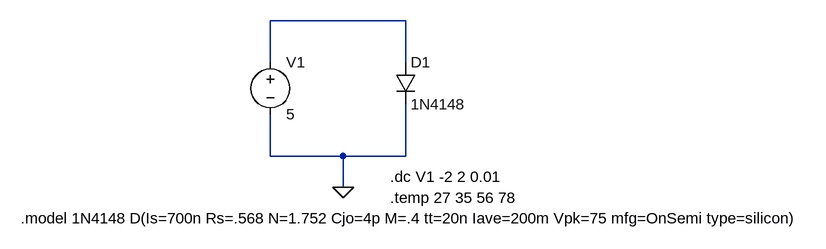
[diagram p0: schematic 1_a_Diodo_Analisis_temp_diferentes.asc]
1_a_Diodo_Analisis_temp_diferentes.asc, the LTspice schematic file:
Version 4
SHEET 1 880 680
WIRE 112 48 -96 48
WIRE -96 112 -96 48
WIRE 112 112 112 48
WIRE -96 256 -96 192
WIRE 16 256 -96 256
WIRE 112 256 112 176
WIRE 112 256 16 256
WIRE 16 304 16 256
FLAG 16 304 0
SYMBOL diode 96 112 R0
SYMATTR InstName D1
SYMATTR Value 1N4148
SYMBOL voltage -96 96 R0
WINDOW 123 0 0 Left 0
WINDOW 39 0 0 Left 0
SYMATTR InstName V1
SYMATTR Value 5
TEXT 88 288 Left 2 !.dc V1 -2 2 0.01
TEXT 88 320 Left 2 !.temp 27 35 56 78
TEXT -480 352 Left 2 !.model 1N4148 D(Is=700n Rs=.568 N=1.752 Cjo=4p M=.4 tt=20n Iave=200m Vpk=75 mfg=OnSemi type=silicon)

The netlist it stands for:
* 1_a_Diodo_Analisis_temp_diferentes.asc
D1 N001 0 1N4148
V1 N001 0 5
.model D D
.lib standard.dio
.dc V1 -2 2 0.01
.temp 27 35 56 78
.model 1N4148 D(Is=700n Rs=.568 N=1.752 Cjo=4p M=.4 tt=20n Iave=200m Vpk=75 mfg=OnSemi type=silicon)
.backanno
.end